# EAGLE design Tiny 5 Circle PTH -v3 (EAGLE 6.2)
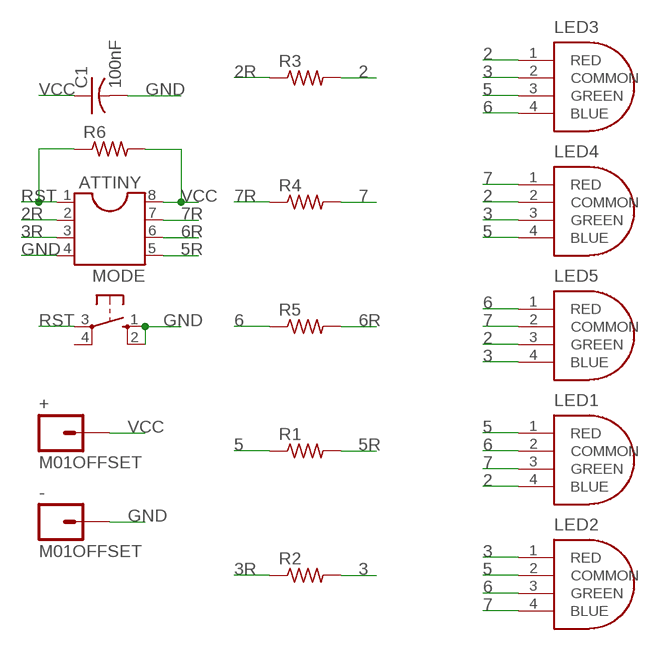
[diagram p0: schematic, sheet 1]

## Parts
+  M01OFFSET  [1X01_OFFSET]
-  M01OFFSET  [1X01_OFFSET]
ATTINY  DIL8S  [SOCKET-08]
C1  100nF  C-US025-025X050  [C025-025X050]
LED1  10MM-RGB-LEDACTIVELYUSED  [10MM-RGB-LED-IN-USE]
LED2  10MM-RGB-LEDACTIVELYUSED  [10MM-RGB-LED-IN-USE]
LED3  10MM-RGB-LEDACTIVELYUSED  [10MM-RGB-LED-IN-USE]
LED4  10MM-RGB-LEDACTIVELYUSED  [10MM-RGB-LED-IN-USE]
LED5  10MM-RGB-LEDACTIVELYUSED  [10MM-RGB-LED-IN-USE]
MODE  10-XX  [B3F-10XX]
R1  R-US_0207/7  [0207/7]
R2  R-US_0207/7  [0207/7]
R3  R-US_0207/7  [0207/7]
R4  R-US_0207/7  [0207/7]
R5  R-US_0207/7  [0207/7]
R6  R-US_0207/2V  [0207/2V]

## Nets
2: LED1.4(BLUE) LED3.1(RED) LED4.2(COMMON) LED5.3(GREEN) R3.2
2R: ATTINY.2 R3.1
3: LED2.1(RED) LED3.2(COMMON) LED4.3(GREEN) LED5.4(BLUE) R2.2
3R: ATTINY.3 R2.1
5: LED1.1(RED) LED2.2(COMMON) LED3.3(GREEN) LED4.4(BLUE) R1.1
5R: ATTINY.5 R1.2
6: LED1.2(COMMON) LED2.3(GREEN) LED3.4(BLUE) LED5.1(RED) R5.1
6R: ATTINY.6 R5.2
7: LED1.3(GREEN) LED2.4(BLUE) LED4.1(RED) LED5.2(COMMON) R4.2
7R: ATTINY.7 R4.1
GND: -.1 ATTINY.4 C1.2 MODE.1(S) MODE.2(S1)
RST: ATTINY.1 MODE.3(P) R6.1
VCC: +.1 ATTINY.8 C1.1 R6.2
Unconnected: MODE.4(P1)

## Library data of the parts
+ - = SparkFun:M01: Header 1 Standard 1-pin 0.1" header. Use with straight break away headers (SKU : PRT-00116), right angle break away headers (PRT-00553), swiss pins (PRT-00743), machine pins (PRT-00117), and female headers (PRT-00115).
ATTINY = ic-package:DIL8: Dual In Line / Socket
C1 = adafruit:C-US: CAPACITOR, American symbol
LED1-LED5 = 00_PERSONAL:10MM-RGB-LED
MODE = switch-omron:10-XX: OMRON SWITCH; MPN: B3F-1000; OC_FARNELL: 176432; OC_NEWARK: 36M3542
R1-R6 = 00_PERSONAL:R-US_: RESISTOR, American symbol

## Board
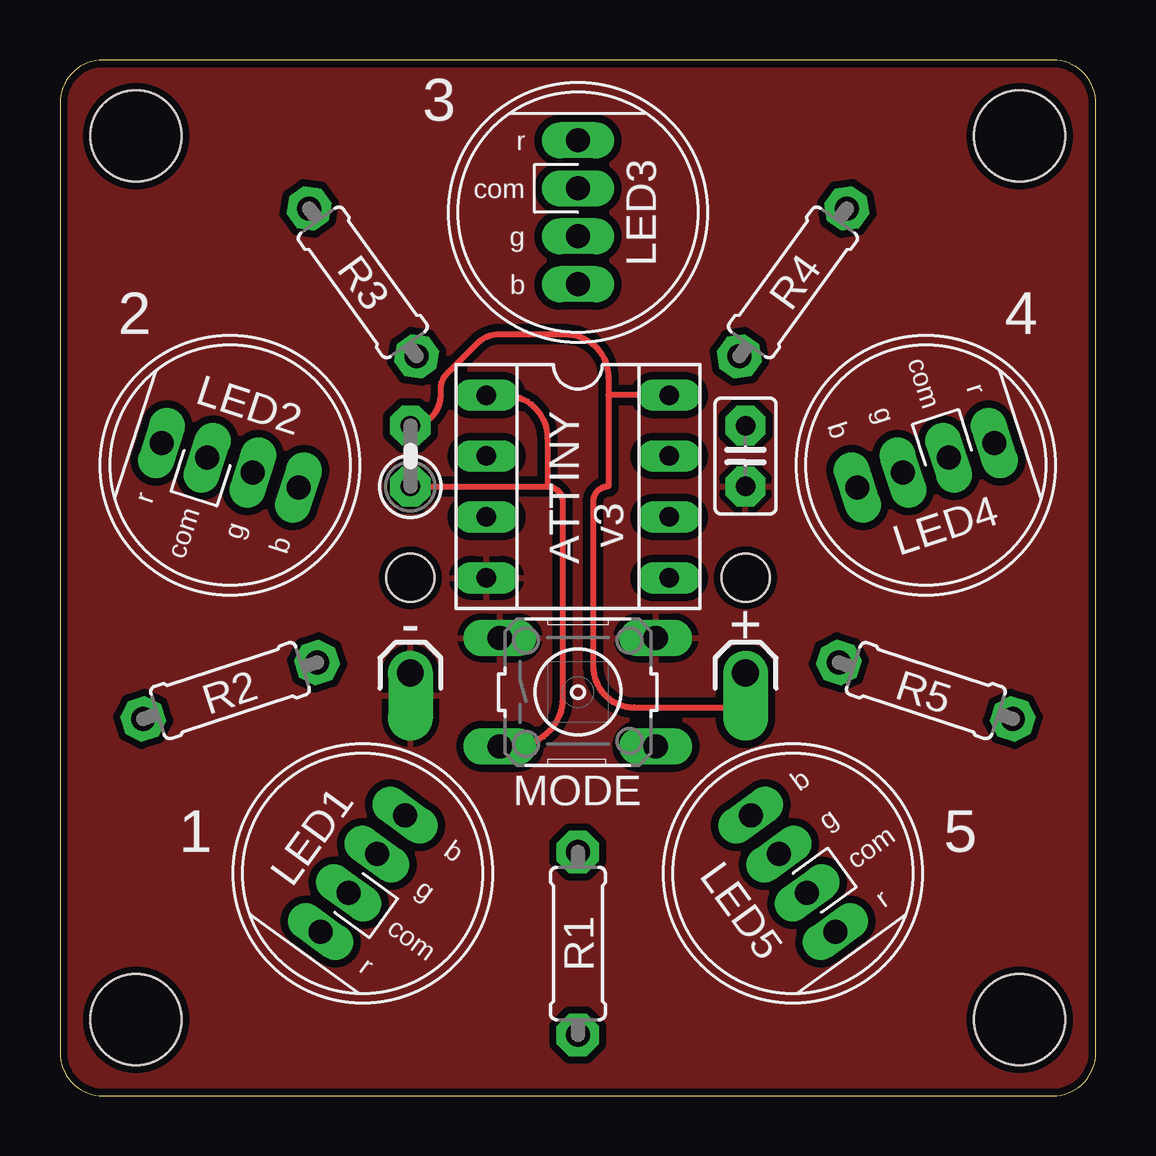
[diagram p1: board, top side]
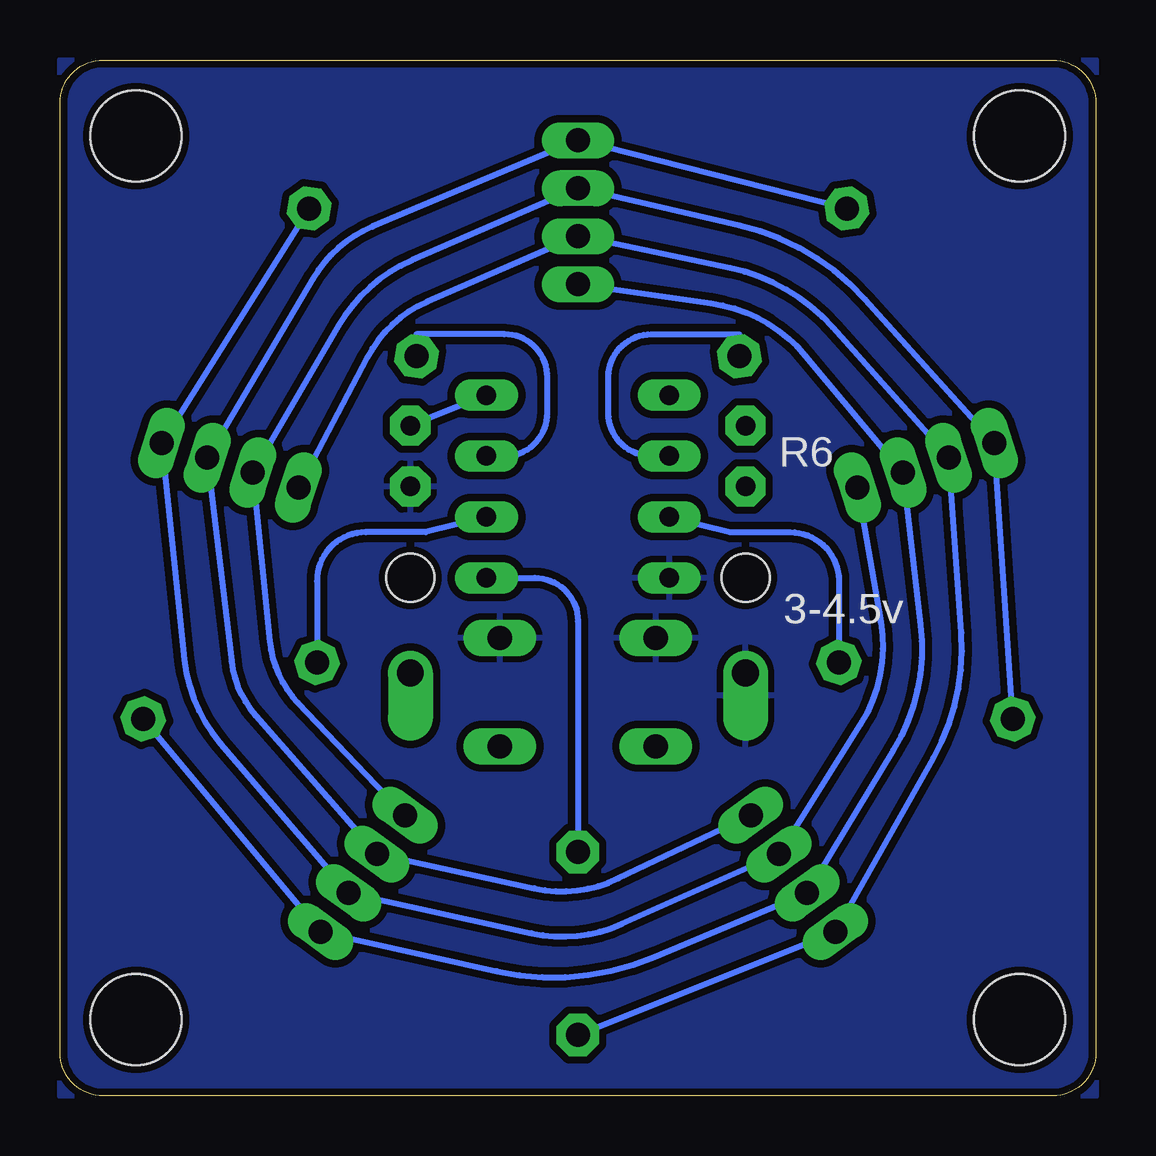
[diagram p2: board, bottom side, seen from below]

Size 43.18 x 43.18 mm. Coordinates in mm from the lower left corner, seen from the top.
Outline: 0,41.38 0,1.8 arc90 1.8,0 41.38,0 arc90 43.18,1.8 43.18,41.38 arc90 41.38,43.18 1.8,43.18 arc90 0,41.38
Copper layers (1*16): Top 0.035mm / dielectric 1.5mm / Bottom 0.035mm
Design rules: minimum track width 6mil, minimum drill 12mil, track to track 6mil, track to pad 6mil, pad to pad 6mil, via to via 6mil, smd to smd 0mil, copper to edge 10mil, drill to drill 10mil, minimum pad ring 10mil, minimum via ring 6mil, stop-mask expansion 2mil, vias tented up to drill 100mil, thermal gap 10mil
Holes 2 mm at 14.61,21.59 28.57,21.59
Holes 3.8 mm at 3.17,40.01 40.01,40.01 3.17,3.17 40.01,3.17

### Footprints (pad centres in the part's own frame; a part is rotated, then mirrored left to right if it is on the bottom)
1X01_OFFSET = drill 1.118 pad 1.88 offset: 1 0,0
SOCKET-08 = drill 0.813 long: 1 -3.81,-3.81; 2 -1.27,-3.81; 3 1.27,-3.81; 4 3.81,-3.81; 5 3.81,3.81; 6 1.27,3.81; 7 -1.27,3.81; 8 -3.81,3.81
C025-025X050 = drill 0.813 pad 1.676 octagon: 1 -1.27,0; 2 1.27,0
10MM-RGB-LED-IN-USE = drill 1 long: 1 3,0; 2 1,0; 3 -1,0; 4 -3,0
B3F-10XX = drill 1.016 long: 1 -3.251,2.261; 2 3.251,2.261; 3 -3.251,-2.261; 4 3.251,-2.261
0207/7 = drill 1 pad 1.778 octagon: 1 -3.81,0; 2 3.81,0
0207/2V = drill 0.813 pad 1.676 octagon: 1 -1.27,0; 2 1.27,0

### Placement (x,y rotation side)
+  28.57,17.62 180 top
-  14.61,17.62 180 top
ATTINY  21.59,25.4 270 top
C1  28.57,26.67 270 top
LED1  12.62,9.27 234 top
LED2  7.09,26.29 162 top
LED3  21.59,36.83 90 top
LED4  36.09,26.29 18 top
LED5  30.56,9.27 306 top
MODE  21.59,16.83 0 top
R1  21.59,6.35 90 top
R2  7.09,16.89 198 top
R3  12.62,33.91 126 top
R4  30.56,33.91 54 top
R5  36.09,16.89 162 top
R6  14.61,26.67 90 top

### Tracks (layer width: path | path; a pad name or v marks a point on that pad's centre or on a via)
2
  Bottom 0.254: R3.2 LED3.1 30.16,36.23 arc-37 32.63,34.08 LED4.2 36.03,18.11 arc-34 35.03,15.86 LED5.3 23.41,8.65 arc-38 19.91,9.06 LED1.4
2R
  Bottom 0.254: ATTINY.2 18.52,26.67 arc90 20.32,28.47 20.32,29.95 arc90 18.52,31.75 14.86,31.75 R3.1
3
  Bottom 0.254: R2.2 LED2.1 9.62,33.2 arc-35 14.85,36.27 LED3.2 28.51,34.83 arc-36 31.56,32.12 LED4.3 34.44,18.94 arc-38 33.27,16.39 LED5.4
3R
  Bottom 0.254: ATTINY.3 15.24,23.5 12.75,23.5 arc90 10.71,21.46 R2.1
5
  Bottom 0.254: R1.1 LED1.1 6.78,14.07 arc-34 5.6,19.3 LED2.2 10.97,32.03 arc-37 15.25,34.51 LED3.3 27.86,33.11 arc-39 30.38,30.78 LED4.4
5R
  Bottom 0.254: ATTINY.5 23.39,21.59 arc90 21.59,19.79 R1.2
6
  Bottom 0.254: R5.1 LED5.1 24.97,5.2 arc-35 18.4,5.79 LED1.2 8.44,14.41 arc-38 7.31,19.63 LED2.3 12.1,30.84 arc-42 16.05,33.04 LED3.4
6R
  Bottom 0.254: ATTINY.6 27.94,23.5 30.43,23.5 arc-90 32.47,21.46 R5.2
7
  Bottom 0.254: R4.2 LED4.1 37.99,18.18 arc-35 36.48,14.67 LED5.2 23.53,6.78 arc-36 19.77,7.16 LED1.3 9.8,15.5 arc-42 8.97,19.75 LED2.4
7R
  Bottom 0.254: ATTINY.7 24.66,26.67 arc-90 22.86,28.47 22.86,29.95 arc-90 24.66,31.75 28.32,31.75 R4.1
GND
  pour Bottom (isolate 0.305): 0,43.18 0,0 43.18,0 43.18,43.18
  pour Top (isolate 0.305): 0,43.18 0,0 43.18,0 43.18,43.18
RST
  Top 0.254: ATTINY.1 18.52,29.21 arc-90 20.32,27.41 20.32,25.4 | R6.1 20.32,25.4 | 20.32,25.4 arc-90 20.95,24.77 20.95,16.61 arc-90 18.91,14.57 MODE.3
VCC
  Top 0.254: ATTINY.8 22.86,29.21 | 22.86,29.21 22.86,25.4 arc90 22.23,24.77 22.23,17.9 arc90 23.93,16.19 28.57,16.19 +.1 | R6.2 arc90 15.88,29.21 15.88,29.47 arc-45 16.14,30.11 17.41,31.38 arc-45 18.31,31.75 21.06,31.75 arc-90 22.86,29.95 22.86,29.21
  Bottom 0.254: ATTINY.8 C1.1

### Text on the board
tPlace: 3 | 2 | 4 | v3 | 1 | 5
bPlace: 3-4.5v
bStop: \\O_o/ | pfriedel | 2012